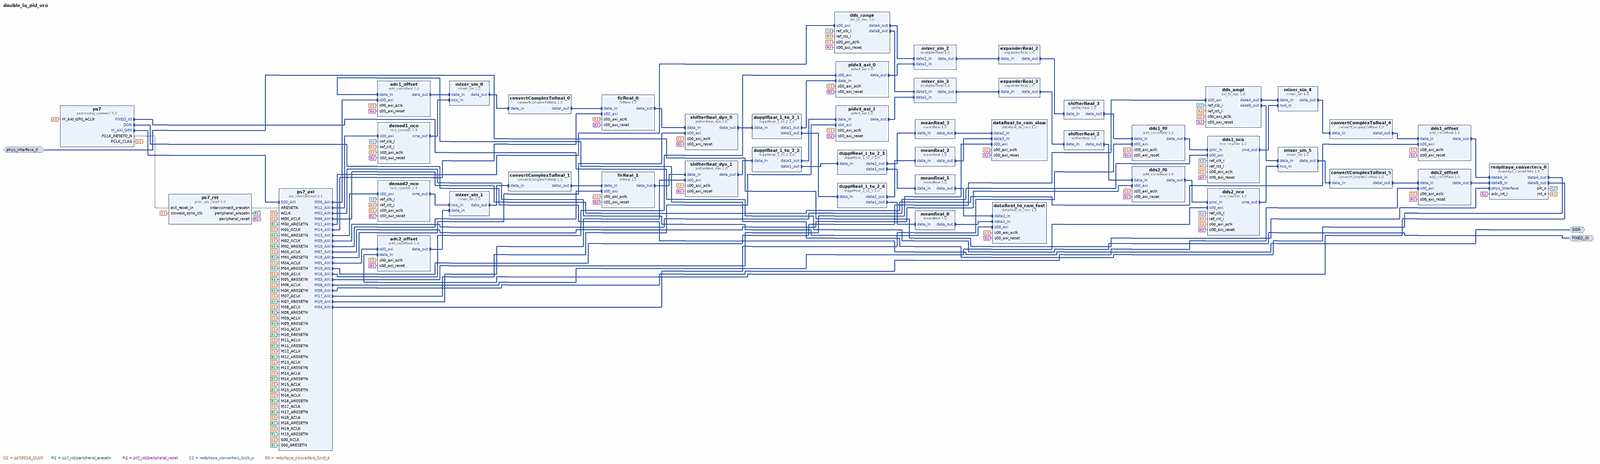
[diagram p0: block diagram of the top level, whole]
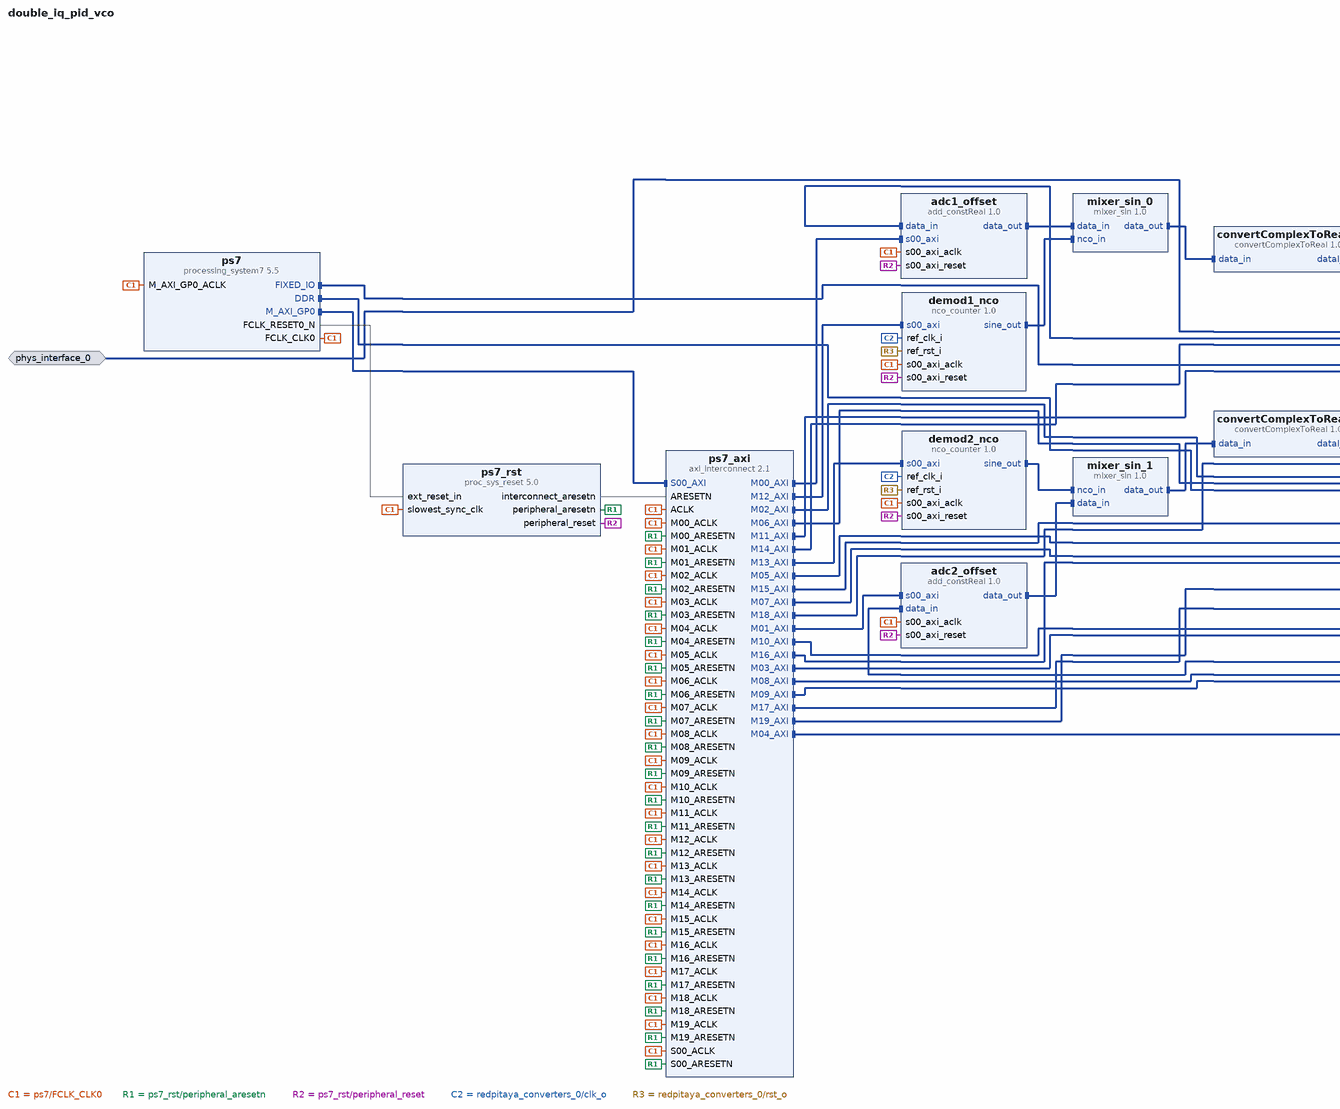
[diagram p1: block diagram of the top level, left part]
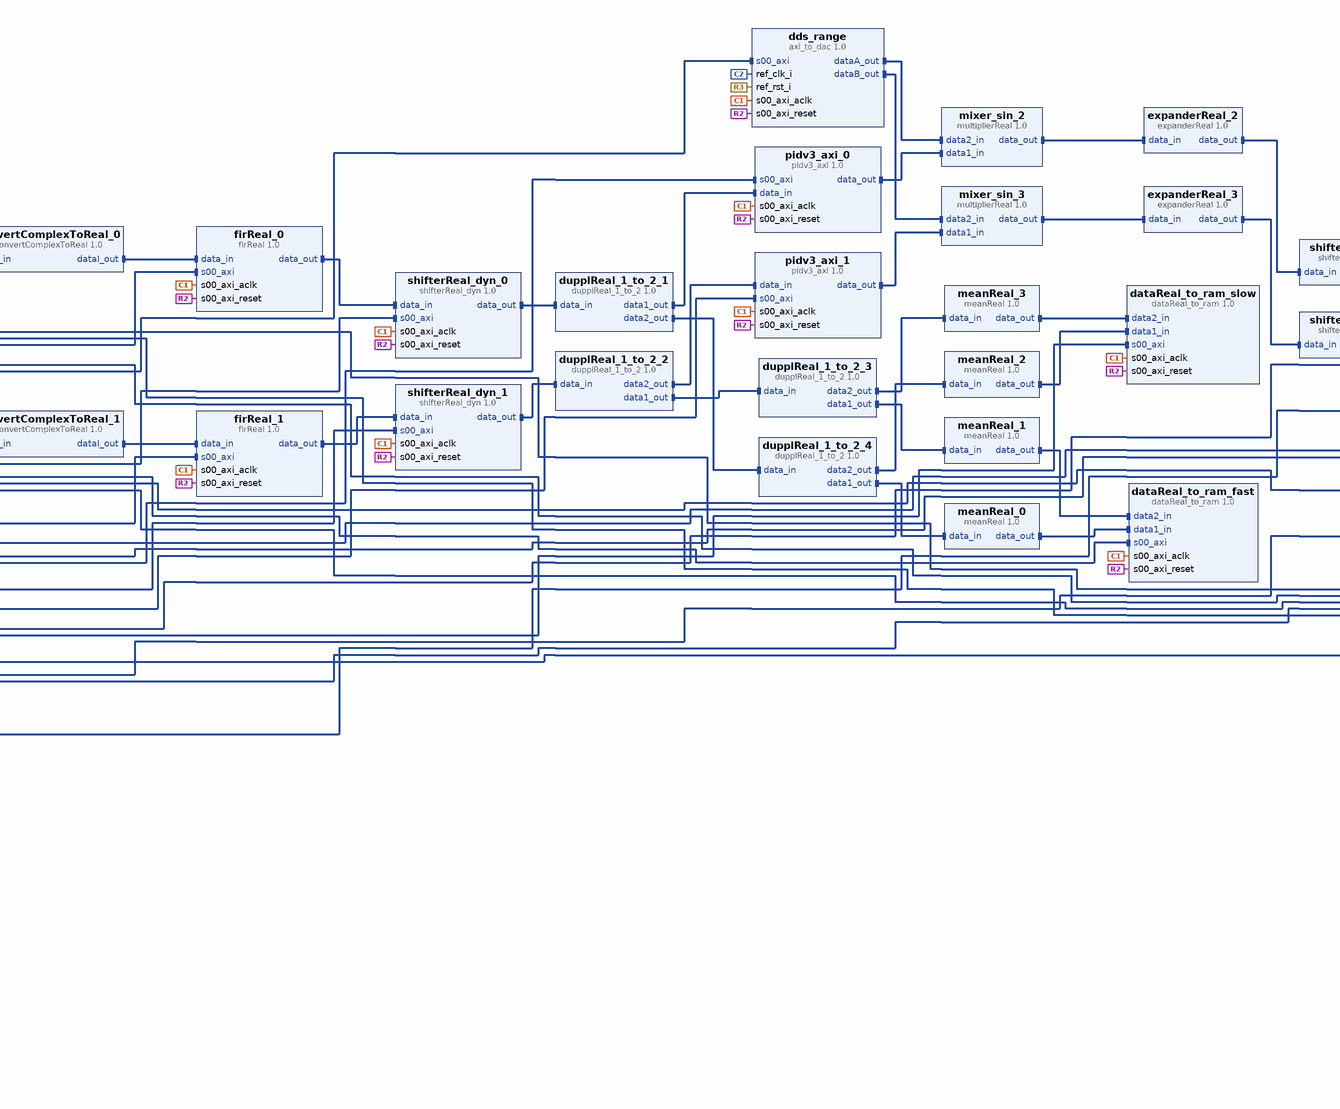
[diagram p2: block diagram of the top level, centre part]
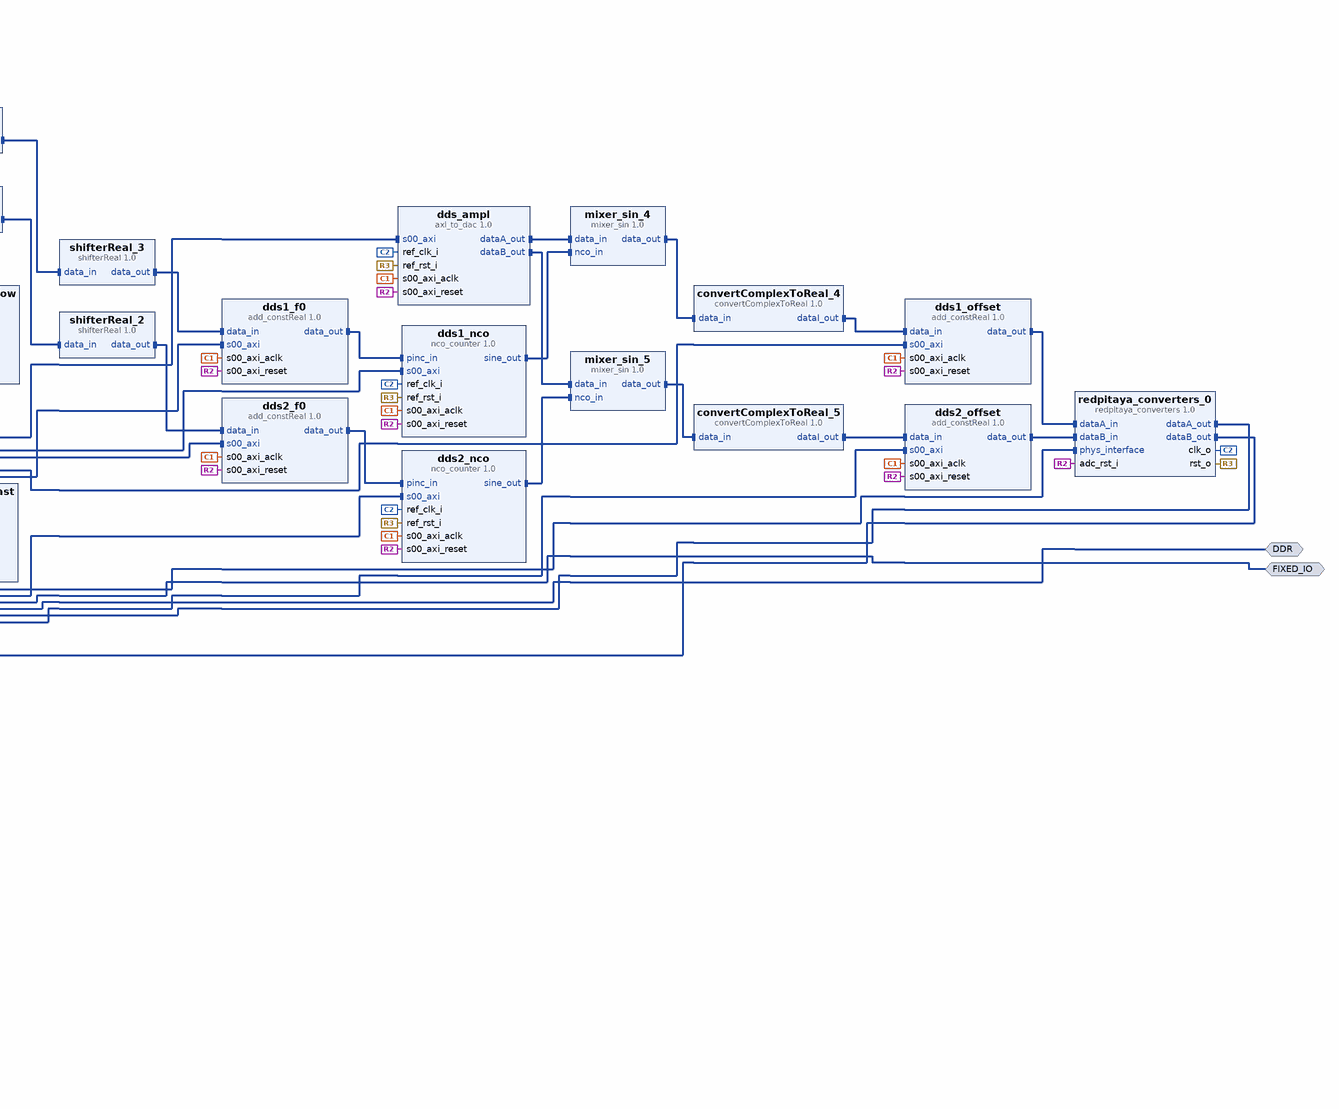
[diagram p3: block diagram of the top level, right part]
# Vivado block design double_iq_pid_vco, xc7z010clg400-1, Vivado 2019.2
create_bd_design double_iq_pid_vco

create_bd_intf_port -mode Master -vlnv xilinx.com:interface:ddrx_rtl:1.0 DDR
create_bd_intf_port -mode Master -vlnv xilinx.com:display_processing_system7:fixedio_rtl:1.0 FIXED_IO
create_bd_intf_port -mode Slave -vlnv ggm:interface:redpitaya_converters_if_rtl:1.0 phys_interface_0

create_bd_cell -type ip -vlnv xilinx.com:ip:processing_system7:5.5 ps7
set_property -dict [list \
  CONFIG.PCW_APU_PERIPHERAL_FREQMHZ 666.666666 \
  CONFIG.PCW_ENET0_ENET0_IO {MIO 16 .. 27} \
  CONFIG.PCW_ENET0_GRP_MDIO_ENABLE 1 \
  CONFIG.PCW_ENET0_GRP_MDIO_IO EMIO \
  CONFIG.PCW_ENET0_PERIPHERAL_ENABLE 1 \
  CONFIG.PCW_ENET0_RESET_ENABLE 0 \
  CONFIG.PCW_ENET_RESET_ENABLE 1 \
  CONFIG.PCW_ENET_RESET_SELECT {Share reset pin} \
  CONFIG.PCW_FPGA0_PERIPHERAL_FREQMHZ 125.000000 \
  CONFIG.PCW_FPGA1_PERIPHERAL_FREQMHZ 250.000000 \
  CONFIG.PCW_FPGA3_PERIPHERAL_FREQMHZ 200.000000 \
  CONFIG.PCW_GPIO_MIO_GPIO_ENABLE 1 \
  CONFIG.PCW_GPIO_MIO_GPIO_IO MIO \
  CONFIG.PCW_GPIO_PERIPHERAL_ENABLE 1 \
  CONFIG.PCW_I2C0_GRP_INT_ENABLE 0 \
  CONFIG.PCW_I2C0_I2C0_IO {MIO 50 .. 51} \
  CONFIG.PCW_I2C0_PERIPHERAL_ENABLE 1 \
  CONFIG.PCW_I2C_PERIPHERAL_FREQMHZ 111.111115 \
  CONFIG.PCW_I2C_RESET_ENABLE 1 \
  CONFIG.PCW_I2C_RESET_SELECT {Share reset pin} \
  CONFIG.PCW_IMPORT_BOARD_PRESET /home/bma/git/github/oscimpDigital/fpga_ip/preset/redpitaya_preset.xml \
  CONFIG.PCW_PRESET_BANK1_VOLTAGE {LVCMOS 2.5V} \
  CONFIG.PCW_QSPI_GRP_SINGLE_SS_ENABLE 1 \
  CONFIG.PCW_QSPI_GRP_SINGLE_SS_IO {MIO 1 .. 6} \
  CONFIG.PCW_QSPI_PERIPHERAL_ENABLE 1 \
  CONFIG.PCW_QSPI_PERIPHERAL_FREQMHZ 125 \
  CONFIG.PCW_QSPI_QSPI_IO {MIO 1 .. 6} \
  CONFIG.PCW_SD0_GRP_CD_ENABLE 1 \
  CONFIG.PCW_SD0_GRP_CD_IO {MIO 46} \
  CONFIG.PCW_SD0_GRP_WP_ENABLE 1 \
  CONFIG.PCW_SD0_GRP_WP_IO {MIO 47} \
  CONFIG.PCW_SD0_PERIPHERAL_ENABLE 1 \
  CONFIG.PCW_SD0_SD0_IO {MIO 40 .. 45} \
  CONFIG.PCW_SDIO_PERIPHERAL_FREQMHZ 100 \
  CONFIG.PCW_SINGLE_QSPI_DATA_MODE x4 \
  CONFIG.PCW_SPI0_PERIPHERAL_ENABLE 1 \
  CONFIG.PCW_SPI0_SPI0_IO EMIO \
  CONFIG.PCW_SPI1_PERIPHERAL_ENABLE 1 \
  CONFIG.PCW_SPI1_SPI1_IO {MIO 10 .. 15} \
  CONFIG.PCW_TTC0_PERIPHERAL_ENABLE 1 \
  CONFIG.PCW_TTC0_TTC0_IO EMIO \
  CONFIG.PCW_UART0_PERIPHERAL_ENABLE 1 \
  CONFIG.PCW_UART0_UART0_IO {MIO 14 .. 15} \
  CONFIG.PCW_UART1_PERIPHERAL_ENABLE 1 \
  CONFIG.PCW_UART1_UART1_IO {MIO 8 .. 9} \
  CONFIG.PCW_UART_PERIPHERAL_FREQMHZ 100 \
  CONFIG.PCW_UIPARAM_DDR_BUS_WIDTH {16 Bit} \
  CONFIG.PCW_UIPARAM_DDR_FREQ_MHZ 533.333333 \
  CONFIG.PCW_UIPARAM_DDR_PARTNO {MT41J256M16 RE-125} \
  CONFIG.PCW_USB0_PERIPHERAL_ENABLE 1 \
  CONFIG.PCW_USB0_RESET_ENABLE 1 \
  CONFIG.PCW_USB0_RESET_IO {MIO 48} \
  CONFIG.PCW_USB0_USB0_IO {MIO 28 .. 39} \
  CONFIG.PCW_USB_RESET_ENABLE 1 \
  CONFIG.PCW_USB_RESET_SELECT {Share reset pin} \
] [get_bd_cells ps7]
# 429 more settings of ps7 are not shown: defaults, MIO pin electricals, DDR timing, and values the tool derives
create_bd_cell -type ip -vlnv xilinx.com:ip:proc_sys_reset:5.0 ps7_rst
create_bd_cell -type ip -vlnv ggm:cogen:redpitaya_converters:1.0 redpitaya_converters_0
set_property -dict {CONFIG.CLOCK_DUTY_CYCLE_STABILIZER_EN false} [get_bd_cells redpitaya_converters_0]
create_bd_cell -type ip -vlnv ggm:cogen:add_constReal:1.0 adc1_offset
set_property -dict {CONFIG.DATA_IN_SIZE 14 CONFIG.DATA_OUT_SIZE 14} [get_bd_cells adc1_offset]
create_bd_cell -type ip -vlnv xilinx.com:ip:axi_interconnect:2.1 ps7_axi
set_property -dict {CONFIG.NUM_MI 20} [get_bd_cells ps7_axi]
create_bd_cell -type ip -vlnv ggm:cogen:add_constReal:1.0 adc2_offset
set_property -dict {CONFIG.DATA_IN_SIZE 14 CONFIG.DATA_OUT_SIZE 14} [get_bd_cells adc2_offset]
create_bd_cell -type ip -vlnv ggm:cogen:convertComplexToReal:1.0 convertComplexToReal_0
set_property -dict {CONFIG.DATA_SIZE 14} [get_bd_cells convertComplexToReal_0]
create_bd_cell -type ip -vlnv ggm:cogen:convertComplexToReal:1.0 convertComplexToReal_1
set_property -dict {CONFIG.DATA_SIZE 14} [get_bd_cells convertComplexToReal_1]
create_bd_cell -type ip -vlnv ggm:cogen:convertComplexToReal:1.0 convertComplexToReal_4
set_property -dict {CONFIG.DATA_SIZE 14} [get_bd_cells convertComplexToReal_4]
create_bd_cell -type ip -vlnv ggm:cogen:convertComplexToReal:1.0 convertComplexToReal_5
set_property -dict {CONFIG.DATA_SIZE 14} [get_bd_cells convertComplexToReal_5]
create_bd_cell -type ip -vlnv ggm:cogen:dataReal_to_ram:1.0 dataReal_to_ram_fast
set_property -dict {CONFIG.DATA_SIZE 16 CONFIG.NB_INPUT 2 CONFIG.NB_SAMPLE 1024} [get_bd_cells dataReal_to_ram_fast]
create_bd_cell -type ip -vlnv ggm:cogen:dataReal_to_ram:1.0 dataReal_to_ram_slow
set_property -dict {CONFIG.DATA_SIZE 16 CONFIG.NB_INPUT 2 CONFIG.NB_SAMPLE 2048} [get_bd_cells dataReal_to_ram_slow]
create_bd_cell -type ip -vlnv ggm:cogen:add_constReal:1.0 dds1_f0
set_property -dict {CONFIG.DATA_IN_SIZE 40 CONFIG.DATA_OUT_SIZE 40 CONFIG.format unsigned} [get_bd_cells dds1_f0]
create_bd_cell -type ip -vlnv ggm:cogen:nco_counter:1.0 dds1_nco
set_property -dict {CONFIG.COUNTER_SIZE 40 CONFIG.DATA_SIZE 16 CONFIG.LUT_SIZE 12} [get_bd_cells dds1_nco]
create_bd_cell -type ip -vlnv ggm:cogen:add_constReal:1.0 dds1_offset
set_property -dict {CONFIG.DATA_IN_SIZE 14 CONFIG.DATA_OUT_SIZE 14 CONFIG.format signed} [get_bd_cells dds1_offset]
create_bd_cell -type ip -vlnv ggm:cogen:add_constReal:1.0 dds2_f0
set_property -dict {CONFIG.DATA_IN_SIZE 40 CONFIG.DATA_OUT_SIZE 40 CONFIG.format unsigned} [get_bd_cells dds2_f0]
create_bd_cell -type ip -vlnv ggm:cogen:nco_counter:1.0 dds2_nco
set_property -dict {CONFIG.COUNTER_SIZE 40 CONFIG.DATA_SIZE 16 CONFIG.LUT_SIZE 12} [get_bd_cells dds2_nco]
create_bd_cell -type ip -vlnv ggm:cogen:add_constReal:1.0 dds2_offset
set_property -dict {CONFIG.DATA_IN_SIZE 14 CONFIG.DATA_OUT_SIZE 14 CONFIG.format signed} [get_bd_cells dds2_offset]
create_bd_cell -type ip -vlnv ggm:cogen:axi_to_dac:1.0 dds_ampl
set_property -dict {CONFIG.DATA_SIZE 14 CONFIG.SYNCHRONIZE_CHAN false} [get_bd_cells dds_ampl]
create_bd_cell -type ip -vlnv ggm:cogen:axi_to_dac:1.0 dds_range
set_property -dict {CONFIG.DATA_SIZE 14 CONFIG.SYNCHRONIZE_CHAN false} [get_bd_cells dds_range]
create_bd_cell -type ip -vlnv ggm:cogen:nco_counter:1.0 demod1_nco
set_property -dict {CONFIG.COUNTER_SIZE 40 CONFIG.DATA_SIZE 16 CONFIG.LUT_SIZE 12} [get_bd_cells demod1_nco]
create_bd_cell -type ip -vlnv ggm:cogen:nco_counter:1.0 demod2_nco
set_property -dict {CONFIG.COUNTER_SIZE 40 CONFIG.DATA_SIZE 16 CONFIG.LUT_SIZE 12} [get_bd_cells demod2_nco]
create_bd_cell -type ip -vlnv ggm:cogen:dupplReal_1_to_2:1.0 dupplReal_1_to_2_1
set_property -dict {CONFIG.DATA_SIZE 14} [get_bd_cells dupplReal_1_to_2_1]
create_bd_cell -type ip -vlnv ggm:cogen:dupplReal_1_to_2:1.0 dupplReal_1_to_2_2
set_property -dict {CONFIG.DATA_SIZE 14} [get_bd_cells dupplReal_1_to_2_2]
create_bd_cell -type ip -vlnv ggm:cogen:dupplReal_1_to_2:1.0 dupplReal_1_to_2_3
set_property -dict {CONFIG.DATA_SIZE 14} [get_bd_cells dupplReal_1_to_2_3]
create_bd_cell -type ip -vlnv ggm:cogen:dupplReal_1_to_2:1.0 dupplReal_1_to_2_4
set_property -dict {CONFIG.DATA_SIZE 14} [get_bd_cells dupplReal_1_to_2_4]
create_bd_cell -type ip -vlnv ggm:cogen:expanderReal:1.0 expanderReal_2
set_property -dict {CONFIG.DATA_IN_SIZE 14 CONFIG.DATA_OUT_SIZE 19} [get_bd_cells expanderReal_2]
create_bd_cell -type ip -vlnv ggm:cogen:expanderReal:1.0 expanderReal_3
set_property -dict {CONFIG.DATA_IN_SIZE 14 CONFIG.DATA_OUT_SIZE 19} [get_bd_cells expanderReal_3]
create_bd_cell -type ip -vlnv ggm:cogen:firReal:1.0 firReal_0
set_property -dict [list \
  CONFIG.DATA_IN_SIZE 14 \
  CONFIG.DATA_OUT_SIZE 32 \
  CONFIG.DECIMATE_FACTOR 1 \
  CONFIG.NB_COEFF 25 \
] [get_bd_cells firReal_0]
create_bd_cell -type ip -vlnv ggm:cogen:firReal:1.0 firReal_1
set_property -dict [list \
  CONFIG.DATA_IN_SIZE 14 \
  CONFIG.DATA_OUT_SIZE 32 \
  CONFIG.DECIMATE_FACTOR 1 \
  CONFIG.NB_COEFF 25 \
] [get_bd_cells firReal_1]
create_bd_cell -type ip -vlnv ggm:cogen:meanReal:1.0 meanReal_0
set_property -dict {CONFIG.DATA_IN_SIZE 14 CONFIG.DATA_OUT_SIZE 16 CONFIG.NB_ACCUM 128 CONFIG.SHIFT 7} [get_bd_cells meanReal_0]
create_bd_cell -type ip -vlnv ggm:cogen:meanReal:1.0 meanReal_1
set_property -dict {CONFIG.DATA_IN_SIZE 14 CONFIG.DATA_OUT_SIZE 16 CONFIG.NB_ACCUM 128 CONFIG.SHIFT 7} [get_bd_cells meanReal_1]
create_bd_cell -type ip -vlnv ggm:cogen:meanReal:1.0 meanReal_2
set_property -dict {CONFIG.DATA_IN_SIZE 14 CONFIG.DATA_OUT_SIZE 16 CONFIG.NB_ACCUM 8192 CONFIG.SHIFT 13} [get_bd_cells meanReal_2]
create_bd_cell -type ip -vlnv ggm:cogen:meanReal:1.0 meanReal_3
set_property -dict {CONFIG.DATA_IN_SIZE 14 CONFIG.DATA_OUT_SIZE 16 CONFIG.NB_ACCUM 8192 CONFIG.SHIFT 13} [get_bd_cells meanReal_3]
create_bd_cell -type ip -vlnv ggm:cogen:mixer_sin:1.0 mixer_sin_0
set_property -dict {CONFIG.DATA_IN_SIZE 14 CONFIG.DATA_OUT_SIZE 14 CONFIG.NCO_SIZE 16} [get_bd_cells mixer_sin_0]
create_bd_cell -type ip -vlnv ggm:cogen:mixer_sin:1.0 mixer_sin_1
set_property -dict {CONFIG.DATA_IN_SIZE 14 CONFIG.DATA_OUT_SIZE 14 CONFIG.NCO_SIZE 16} [get_bd_cells mixer_sin_1]
create_bd_cell -type ip -vlnv ggm:cogen:multiplierReal:1.0 mixer_sin_2
set_property -dict {CONFIG.DATA1_IN_SIZE 14 CONFIG.DATA2_IN_SIZE 14 CONFIG.DATA_OUT_SIZE 14} [get_bd_cells mixer_sin_2]
create_bd_cell -type ip -vlnv ggm:cogen:multiplierReal:1.0 mixer_sin_3
set_property -dict {CONFIG.DATA1_IN_SIZE 14 CONFIG.DATA2_IN_SIZE 14 CONFIG.DATA_OUT_SIZE 14} [get_bd_cells mixer_sin_3]
create_bd_cell -type ip -vlnv ggm:cogen:mixer_sin:1.0 mixer_sin_4
set_property -dict {CONFIG.DATA_IN_SIZE 14 CONFIG.DATA_OUT_SIZE 14 CONFIG.NCO_SIZE 16} [get_bd_cells mixer_sin_4]
create_bd_cell -type ip -vlnv ggm:cogen:mixer_sin:1.0 mixer_sin_5
set_property -dict {CONFIG.DATA_IN_SIZE 14 CONFIG.DATA_OUT_SIZE 14 CONFIG.NCO_SIZE 16} [get_bd_cells mixer_sin_5]
create_bd_cell -type ip -vlnv ggm:cogen:pidv3_axi:1.0 pidv3_axi_0
set_property -dict {CONFIG.DSR 1 CONFIG.ISR 19 CONFIG.I_SIZE 18 CONFIG.PSR 13} [get_bd_cells pidv3_axi_0]
create_bd_cell -type ip -vlnv ggm:cogen:pidv3_axi:1.0 pidv3_axi_1
set_property -dict {CONFIG.DSR 1 CONFIG.ISR 19 CONFIG.I_SIZE 18 CONFIG.PSR 13} [get_bd_cells pidv3_axi_1]
create_bd_cell -type ip -vlnv ggm:cogen:shifterReal:1.0 shifterReal_2
set_property -dict {CONFIG.DATA_IN_SIZE 19 CONFIG.DATA_OUT_SIZE 40} [get_bd_cells shifterReal_2]
create_bd_cell -type ip -vlnv ggm:cogen:shifterReal:1.0 shifterReal_3
set_property -dict {CONFIG.DATA_IN_SIZE 19 CONFIG.DATA_OUT_SIZE 40} [get_bd_cells shifterReal_3]
create_bd_cell -type ip -vlnv ggm:cogen:shifterReal_dyn:1.0 shifterReal_dyn_0
set_property -dict {CONFIG.DATA_OUT_SIZE 14} [get_bd_cells shifterReal_dyn_0]
create_bd_cell -type ip -vlnv ggm:cogen:shifterReal_dyn:1.0 shifterReal_dyn_1
set_property -dict {CONFIG.DATA_OUT_SIZE 14} [get_bd_cells shifterReal_dyn_1]

# ---- connections ----

connect_bd_intf_net [get_bd_intf_pins ps7_axi/M02_AXI] [get_bd_intf_pins dataReal_to_ram_fast/s00_axi]
connect_bd_intf_net [get_bd_intf_pins ps7_axi/M06_AXI] [get_bd_intf_pins dds1_offset/s00_axi]
connect_bd_intf_net [get_bd_intf_pins ps7_axi/M05_AXI] [get_bd_intf_pins dds1_nco/s00_axi]
connect_bd_intf_net [get_bd_intf_pins ps7_axi/M01_AXI] [get_bd_intf_pins adc2_offset/s00_axi]
connect_bd_intf_net [get_bd_intf_pins ps7_axi/M15_AXI] [get_bd_intf_pins firReal_1/s00_axi]
connect_bd_intf_net [get_bd_intf_pins ps7_axi/M07_AXI] [get_bd_intf_pins dds2_f0/s00_axi]
connect_bd_intf_net [get_bd_intf_pins ps7_axi/M10_AXI] [get_bd_intf_pins dds_ampl/s00_axi]
connect_bd_intf_net [get_bd_intf_pins ps7/M_AXI_GP0] [get_bd_intf_pins ps7_axi/S00_AXI]
connect_bd_intf_net [get_bd_intf_pins ps7_axi/M00_AXI] [get_bd_intf_pins adc1_offset/s00_axi]
connect_bd_intf_net [get_bd_intf_pins ps7_axi/M11_AXI] [get_bd_intf_pins dds_range/s00_axi]
connect_bd_intf_net [get_bd_intf_pins ps7_axi/M03_AXI] [get_bd_intf_pins dataReal_to_ram_slow/s00_axi]
connect_bd_intf_net -intf_net phys_interface_0_1 [get_bd_intf_ports phys_interface_0] [get_bd_intf_pins redpitaya_converters_0/phys_interface]
connect_bd_intf_net [get_bd_intf_ports FIXED_IO] [get_bd_intf_pins ps7/FIXED_IO]
connect_bd_intf_net [get_bd_intf_ports DDR] [get_bd_intf_pins ps7/DDR]
connect_bd_intf_net [get_bd_intf_pins ps7_axi/M08_AXI] [get_bd_intf_pins dds2_nco/s00_axi]
connect_bd_intf_net [get_bd_intf_pins ps7_axi/M16_AXI] [get_bd_intf_pins pidv3_axi_0/s00_axi]
connect_bd_intf_net [get_bd_intf_pins ps7_axi/M09_AXI] [get_bd_intf_pins dds2_offset/s00_axi]
connect_bd_intf_net [get_bd_intf_pins ps7_axi/M04_AXI] [get_bd_intf_pins dds1_f0/s00_axi]
connect_bd_intf_net [get_bd_intf_pins ps7_axi/M14_AXI] [get_bd_intf_pins firReal_0/s00_axi]
connect_bd_intf_net [get_bd_intf_pins ps7_axi/M13_AXI] [get_bd_intf_pins demod2_nco/s00_axi]
connect_bd_intf_net [get_bd_intf_pins ps7_axi/M12_AXI] [get_bd_intf_pins demod1_nco/s00_axi]
connect_bd_intf_net [get_bd_intf_pins ps7_axi/M17_AXI] [get_bd_intf_pins pidv3_axi_1/s00_axi]
connect_bd_intf_net [get_bd_intf_pins convertComplexToReal_0/dataI_out] [get_bd_intf_pins firReal_0/data_in]
connect_bd_intf_net [get_bd_intf_pins ps7_axi/M18_AXI] [get_bd_intf_pins shifterReal_dyn_0/s00_axi]
connect_bd_intf_net [get_bd_intf_pins dds1_nco/sine_out] [get_bd_intf_pins mixer_sin_4/nco_in]
connect_bd_intf_net [get_bd_intf_pins adc1_offset/data_out] [get_bd_intf_pins mixer_sin_0/data_in]
connect_bd_intf_net [get_bd_intf_pins ps7_axi/M19_AXI] [get_bd_intf_pins shifterReal_dyn_1/s00_axi]
connect_bd_intf_net [get_bd_intf_pins dds_ampl/dataA_out] [get_bd_intf_pins mixer_sin_4/data_in]
connect_bd_intf_net [get_bd_intf_pins convertComplexToReal_4/dataI_out] [get_bd_intf_pins dds1_offset/data_in]
connect_bd_intf_net [get_bd_intf_pins dds_ampl/dataB_out] [get_bd_intf_pins mixer_sin_5/data_in]
connect_bd_intf_net [get_bd_intf_pins expanderReal_2/data_out] [get_bd_intf_pins shifterReal_3/data_in]
connect_bd_intf_net [get_bd_intf_pins dupplReal_1_to_2_1/data2_out] [get_bd_intf_pins dupplReal_1_to_2_4/data_in]
connect_bd_intf_net [get_bd_intf_pins mixer_sin_2/data_out] [get_bd_intf_pins expanderReal_2/data_in]
connect_bd_intf_net [get_bd_intf_pins mixer_sin_3/data_out] [get_bd_intf_pins expanderReal_3/data_in]
connect_bd_intf_net [get_bd_intf_pins convertComplexToReal_5/dataI_out] [get_bd_intf_pins dds2_offset/data_in]
connect_bd_intf_net [get_bd_intf_pins expanderReal_3/data_out] [get_bd_intf_pins shifterReal_2/data_in]
connect_bd_intf_net [get_bd_intf_pins adc2_offset/data_out] [get_bd_intf_pins mixer_sin_1/data_in]
connect_bd_intf_net [get_bd_intf_pins dds2_nco/sine_out] [get_bd_intf_pins mixer_sin_5/nco_in]
connect_bd_intf_net [get_bd_intf_pins dupplReal_1_to_2_2/data1_out] [get_bd_intf_pins dupplReal_1_to_2_3/data_in]
connect_bd_intf_net [get_bd_intf_pins dds2_offset/data_out] [get_bd_intf_pins redpitaya_converters_0/dataB_in]
connect_bd_intf_net [get_bd_intf_pins dds1_offset/data_out] [get_bd_intf_pins redpitaya_converters_0/dataA_in]
connect_bd_intf_net [get_bd_intf_pins dataReal_to_ram_slow/data1_in] [get_bd_intf_pins meanReal_2/data_out]
connect_bd_intf_net [get_bd_intf_pins convertComplexToReal_0/data_in] [get_bd_intf_pins mixer_sin_0/data_out]
connect_bd_intf_net [get_bd_intf_pins dupplReal_1_to_2_3/data1_out] [get_bd_intf_pins meanReal_1/data_in]
connect_bd_intf_net [get_bd_intf_pins dupplReal_1_to_2_2/data2_out] [get_bd_intf_pins pidv3_axi_1/data_in]
connect_bd_intf_net [get_bd_intf_pins convertComplexToReal_1/data_in] [get_bd_intf_pins mixer_sin_1/data_out]
connect_bd_intf_net [get_bd_intf_pins convertComplexToReal_5/data_in] [get_bd_intf_pins mixer_sin_5/data_out]
connect_bd_intf_net [get_bd_intf_pins convertComplexToReal_4/data_in] [get_bd_intf_pins mixer_sin_4/data_out]
connect_bd_intf_net [get_bd_intf_pins dataReal_to_ram_slow/data2_in] [get_bd_intf_pins meanReal_3/data_out]
connect_bd_intf_net [get_bd_intf_pins dupplReal_1_to_2_4/data1_out] [get_bd_intf_pins meanReal_0/data_in]
connect_bd_intf_net [get_bd_intf_pins firReal_1/data_out] [get_bd_intf_pins shifterReal_dyn_1/data_in]
connect_bd_intf_net [get_bd_intf_pins firReal_0/data_out] [get_bd_intf_pins shifterReal_dyn_0/data_in]
connect_bd_intf_net [get_bd_intf_pins dupplReal_1_to_2_4/data2_out] [get_bd_intf_pins meanReal_2/data_in]
connect_bd_intf_net [get_bd_intf_pins dupplReal_1_to_2_3/data2_out] [get_bd_intf_pins meanReal_3/data_in]
connect_bd_intf_net [get_bd_intf_pins demod1_nco/sine_out] [get_bd_intf_pins mixer_sin_0/nco_in]
connect_bd_intf_net [get_bd_intf_pins demod2_nco/sine_out] [get_bd_intf_pins mixer_sin_1/nco_in]
connect_bd_intf_net [get_bd_intf_pins dataReal_to_ram_fast/data1_in] [get_bd_intf_pins meanReal_0/data_out]
connect_bd_intf_net [get_bd_intf_pins convertComplexToReal_1/dataI_out] [get_bd_intf_pins firReal_1/data_in]
connect_bd_intf_net [get_bd_intf_pins dataReal_to_ram_fast/data2_in] [get_bd_intf_pins meanReal_1/data_out]
connect_bd_intf_net [get_bd_intf_pins dds1_nco/pinc_in] [get_bd_intf_pins dds1_f0/data_out]
connect_bd_intf_net [get_bd_intf_pins dds2_nco/pinc_in] [get_bd_intf_pins dds2_f0/data_out]
connect_bd_intf_net [get_bd_intf_pins mixer_sin_2/data1_in] [get_bd_intf_pins pidv3_axi_0/data_out]
connect_bd_intf_net [get_bd_intf_pins dupplReal_1_to_2_2/data_in] [get_bd_intf_pins shifterReal_dyn_1/data_out]
connect_bd_intf_net [get_bd_intf_pins dds2_f0/data_in] [get_bd_intf_pins shifterReal_2/data_out]
connect_bd_intf_net [get_bd_intf_pins mixer_sin_3/data1_in] [get_bd_intf_pins pidv3_axi_1/data_out]
connect_bd_intf_net [get_bd_intf_pins adc1_offset/data_in] [get_bd_intf_pins redpitaya_converters_0/dataA_out]
connect_bd_intf_net [get_bd_intf_pins dupplReal_1_to_2_1/data_in] [get_bd_intf_pins shifterReal_dyn_0/data_out]
connect_bd_intf_net [get_bd_intf_pins dds_range/dataB_out] [get_bd_intf_pins mixer_sin_3/data2_in]
connect_bd_intf_net [get_bd_intf_pins dds_range/dataA_out] [get_bd_intf_pins mixer_sin_2/data2_in]
connect_bd_intf_net [get_bd_intf_pins adc2_offset/data_in] [get_bd_intf_pins redpitaya_converters_0/dataB_out]
connect_bd_intf_net [get_bd_intf_pins dds1_f0/data_in] [get_bd_intf_pins shifterReal_3/data_out]
connect_bd_intf_net [get_bd_intf_pins dupplReal_1_to_2_1/data1_out] [get_bd_intf_pins pidv3_axi_0/data_in]
connect_bd_net [get_bd_pins ps7/FCLK_CLK0] \
  [get_bd_pins ps7/M_AXI_GP0_ACLK] [get_bd_pins ps7_rst/slowest_sync_clk] [get_bd_pins ps7_axi/ACLK] \
  [get_bd_pins ps7_axi/S00_ACLK] [get_bd_pins ps7_axi/M00_ACLK] [get_bd_pins adc1_offset/s00_axi_aclk] \
  [get_bd_pins ps7_axi/M01_ACLK] [get_bd_pins adc2_offset/s00_axi_aclk] [get_bd_pins ps7_axi/M02_ACLK] \
  [get_bd_pins dataReal_to_ram_fast/s00_axi_aclk] [get_bd_pins ps7_axi/M03_ACLK] \
  [get_bd_pins dataReal_to_ram_slow/s00_axi_aclk] [get_bd_pins ps7_axi/M04_ACLK] [get_bd_pins dds1_f0/s00_axi_aclk] \
  [get_bd_pins ps7_axi/M05_ACLK] [get_bd_pins dds1_nco/s00_axi_aclk] [get_bd_pins ps7_axi/M06_ACLK] \
  [get_bd_pins dds1_offset/s00_axi_aclk] [get_bd_pins ps7_axi/M07_ACLK] [get_bd_pins dds2_f0/s00_axi_aclk] \
  [get_bd_pins ps7_axi/M08_ACLK] [get_bd_pins dds2_nco/s00_axi_aclk] [get_bd_pins ps7_axi/M09_ACLK] \
  [get_bd_pins dds2_offset/s00_axi_aclk] [get_bd_pins ps7_axi/M10_ACLK] [get_bd_pins dds_ampl/s00_axi_aclk] \
  [get_bd_pins ps7_axi/M11_ACLK] [get_bd_pins dds_range/s00_axi_aclk] [get_bd_pins ps7_axi/M12_ACLK] \
  [get_bd_pins demod1_nco/s00_axi_aclk] [get_bd_pins ps7_axi/M13_ACLK] [get_bd_pins demod2_nco/s00_axi_aclk] \
  [get_bd_pins ps7_axi/M14_ACLK] [get_bd_pins firReal_0/s00_axi_aclk] [get_bd_pins ps7_axi/M15_ACLK] \
  [get_bd_pins firReal_1/s00_axi_aclk] [get_bd_pins ps7_axi/M16_ACLK] [get_bd_pins pidv3_axi_0/s00_axi_aclk] \
  [get_bd_pins ps7_axi/M17_ACLK] [get_bd_pins pidv3_axi_1/s00_axi_aclk] [get_bd_pins ps7_axi/M18_ACLK] \
  [get_bd_pins shifterReal_dyn_0/s00_axi_aclk] [get_bd_pins ps7_axi/M19_ACLK] [get_bd_pins shifterReal_dyn_1/s00_axi_aclk]
connect_bd_net [get_bd_pins ps7/FCLK_RESET0_N] [get_bd_pins ps7_rst/ext_reset_in]
connect_bd_net [get_bd_pins ps7_rst/interconnect_aresetn] [get_bd_pins ps7_axi/ARESETN]
connect_bd_net [get_bd_pins ps7_rst/peripheral_aresetn] \
  [get_bd_pins ps7_axi/S00_ARESETN] [get_bd_pins ps7_axi/M00_ARESETN] [get_bd_pins ps7_axi/M01_ARESETN] \
  [get_bd_pins ps7_axi/M02_ARESETN] [get_bd_pins ps7_axi/M03_ARESETN] [get_bd_pins ps7_axi/M04_ARESETN] \
  [get_bd_pins ps7_axi/M05_ARESETN] [get_bd_pins ps7_axi/M06_ARESETN] [get_bd_pins ps7_axi/M07_ARESETN] \
  [get_bd_pins ps7_axi/M08_ARESETN] [get_bd_pins ps7_axi/M09_ARESETN] [get_bd_pins ps7_axi/M10_ARESETN] \
  [get_bd_pins ps7_axi/M11_ARESETN] [get_bd_pins ps7_axi/M12_ARESETN] [get_bd_pins ps7_axi/M13_ARESETN] \
  [get_bd_pins ps7_axi/M14_ARESETN] [get_bd_pins ps7_axi/M15_ARESETN] [get_bd_pins ps7_axi/M16_ARESETN] \
  [get_bd_pins ps7_axi/M17_ARESETN] [get_bd_pins ps7_axi/M18_ARESETN] [get_bd_pins ps7_axi/M19_ARESETN]
connect_bd_net [get_bd_pins ps7_rst/peripheral_reset] \
  [get_bd_pins adc1_offset/s00_axi_reset] [get_bd_pins adc2_offset/s00_axi_reset] \
  [get_bd_pins dataReal_to_ram_fast/s00_axi_reset] [get_bd_pins dataReal_to_ram_slow/s00_axi_reset] \
  [get_bd_pins dds1_f0/s00_axi_reset] [get_bd_pins dds1_nco/s00_axi_reset] [get_bd_pins dds1_offset/s00_axi_reset] \
  [get_bd_pins dds2_f0/s00_axi_reset] [get_bd_pins dds2_nco/s00_axi_reset] [get_bd_pins dds2_offset/s00_axi_reset] \
  [get_bd_pins dds_ampl/s00_axi_reset] [get_bd_pins dds_range/s00_axi_reset] [get_bd_pins demod1_nco/s00_axi_reset] \
  [get_bd_pins demod2_nco/s00_axi_reset] [get_bd_pins firReal_0/s00_axi_reset] [get_bd_pins firReal_1/s00_axi_reset] \
  [get_bd_pins pidv3_axi_0/s00_axi_reset] [get_bd_pins pidv3_axi_1/s00_axi_reset] \
  [get_bd_pins shifterReal_dyn_0/s00_axi_reset] [get_bd_pins shifterReal_dyn_1/s00_axi_reset] \
  [get_bd_pins redpitaya_converters_0/adc_rst_i]
connect_bd_net [get_bd_pins redpitaya_converters_0/clk_o] \
  [get_bd_pins dds1_nco/ref_clk_i] [get_bd_pins dds2_nco/ref_clk_i] [get_bd_pins dds_ampl/ref_clk_i] \
  [get_bd_pins dds_range/ref_clk_i] [get_bd_pins demod1_nco/ref_clk_i] [get_bd_pins demod2_nco/ref_clk_i]
connect_bd_net [get_bd_pins redpitaya_converters_0/rst_o] \
  [get_bd_pins dds1_nco/ref_rst_i] [get_bd_pins dds2_nco/ref_rst_i] [get_bd_pins dds_ampl/ref_rst_i] \
  [get_bd_pins dds_range/ref_rst_i] [get_bd_pins demod1_nco/ref_rst_i] [get_bd_pins demod2_nco/ref_rst_i]

# ---- address map ----
assign_bd_address -offset 0x43C00000 -range 4K -target_address_space [get_bd_addr_spaces ps7/Data] [get_bd_addr_segs dataReal_to_ram_fast/s00_axi/reg0]
assign_bd_address -offset 0x43C20000 -range 4K -target_address_space [get_bd_addr_spaces ps7/Data] [get_bd_addr_segs shifterReal_dyn_0/s00_axi/reg0]
assign_bd_address -offset 0x43C30000 -range 4K -target_address_space [get_bd_addr_spaces ps7/Data] [get_bd_addr_segs pidv3_axi_0/s00_axi/reg0]
assign_bd_address -offset 0x43C40000 -range 4K -target_address_space [get_bd_addr_spaces ps7/Data] [get_bd_addr_segs adc2_offset/s00_axi/reg0]
assign_bd_address -offset 0x43C50000 -range 4K -target_address_space [get_bd_addr_spaces ps7/Data] [get_bd_addr_segs adc1_offset/s00_axi/reg0]
assign_bd_address -offset 0x43C60000 -range 4K -target_address_space [get_bd_addr_spaces ps7/Data] [get_bd_addr_segs demod1_nco/s00_axi/reg0]
assign_bd_address -offset 0x43C70000 -range 4K -target_address_space [get_bd_addr_spaces ps7/Data] [get_bd_addr_segs demod2_nco/s00_axi/reg0]
assign_bd_address -offset 0x43C80000 -range 4K -target_address_space [get_bd_addr_spaces ps7/Data] [get_bd_addr_segs firReal_0/s00_axi/reg0]
assign_bd_address -offset 0x43C90000 -range 4K -target_address_space [get_bd_addr_spaces ps7/Data] [get_bd_addr_segs firReal_1/s00_axi/reg0]
assign_bd_address -offset 0x43CA0000 -range 4K -target_address_space [get_bd_addr_spaces ps7/Data] [get_bd_addr_segs shifterReal_dyn_1/s00_axi/reg0]
assign_bd_address -offset 0x43CB0000 -range 4K -target_address_space [get_bd_addr_spaces ps7/Data] [get_bd_addr_segs dataReal_to_ram_slow/s00_axi/reg0]
assign_bd_address -offset 0x43D20000 -range 4K -target_address_space [get_bd_addr_spaces ps7/Data] [get_bd_addr_segs dds_range/s00_axi/reg0]
assign_bd_address -offset 0x43D30000 -range 4K -target_address_space [get_bd_addr_spaces ps7/Data] [get_bd_addr_segs dds_ampl/s00_axi/reg0]
assign_bd_address -offset 0x43D40000 -range 4K -target_address_space [get_bd_addr_spaces ps7/Data] [get_bd_addr_segs pidv3_axi_1/s00_axi/reg0]
assign_bd_address -offset 0x43D90000 -range 4K -target_address_space [get_bd_addr_spaces ps7/Data] [get_bd_addr_segs dds1_f0/s00_axi/reg0]
assign_bd_address -offset 0x43DA0000 -range 4K -target_address_space [get_bd_addr_spaces ps7/Data] [get_bd_addr_segs dds1_nco/s00_axi/reg0]
assign_bd_address -offset 0x43DB0000 -range 4K -target_address_space [get_bd_addr_spaces ps7/Data] [get_bd_addr_segs dds2_f0/s00_axi/reg0]
assign_bd_address -offset 0x43DD0000 -range 4K -target_address_space [get_bd_addr_spaces ps7/Data] [get_bd_addr_segs dds2_nco/s00_axi/reg0]
assign_bd_address -offset 0x43E00000 -range 4K -target_address_space [get_bd_addr_spaces ps7/Data] [get_bd_addr_segs dds1_offset/s00_axi/reg0]
assign_bd_address -offset 0x43E10000 -range 4K -target_address_space [get_bd_addr_spaces ps7/Data] [get_bd_addr_segs dds2_offset/s00_axi/reg0]

validate_bd_design
save_bd_design
